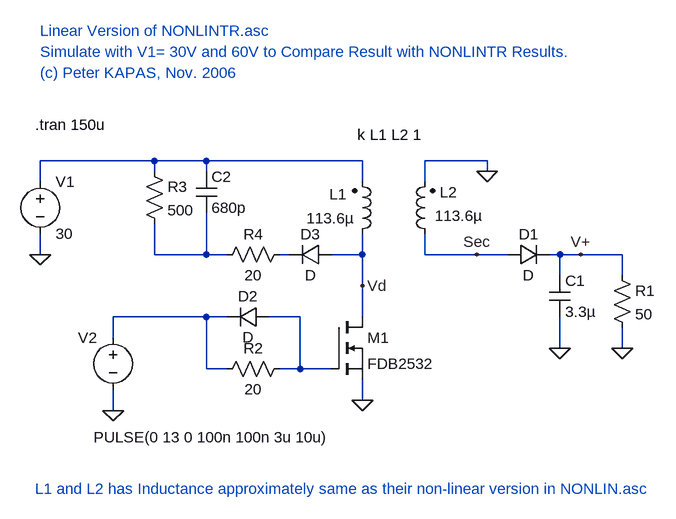
[diagram p0: schematic lineartr.asc]
lineartr.asc, the LTspice schematic file:
Version 4
SHEET 1 880 680
WIRE -256 144 -432 144
WIRE -176 144 -256 144
WIRE 64 144 -176 144
WIRE 256 144 160 144
WIRE -256 160 -256 144
WIRE -176 160 -176 144
WIRE 256 160 256 144
WIRE -432 176 -432 144
WIRE 64 176 64 144
WIRE 160 176 160 144
WIRE -432 288 -432 256
WIRE -256 288 -256 240
WIRE -176 288 -176 224
WIRE -176 288 -256 288
WIRE -144 288 -176 288
WIRE -48 288 -64 288
WIRE 64 288 64 256
WIRE 64 288 16 288
WIRE 160 288 160 256
WIRE 240 288 160 288
WIRE 288 288 240 288
WIRE 368 288 352 288
WIRE 400 288 368 288
WIRE 464 288 400 288
WIRE 368 320 368 288
WIRE 464 320 464 288
WIRE 64 336 64 288
WIRE -176 384 -320 384
WIRE -144 384 -176 384
WIRE -32 384 -80 384
WIRE 64 384 64 336
WIRE -320 416 -320 384
WIRE 368 432 368 384
WIRE 464 432 464 400
WIRE -176 464 -176 384
WIRE -144 464 -176 464
WIRE -32 464 -32 384
WIRE -32 464 -64 464
WIRE 16 464 -32 464
WIRE 64 512 64 480
WIRE -320 528 -320 496
FLAG -432 288 0
FLAG 240 288 Sec
FLAG 368 432 0
FLAG 464 432 0
FLAG 64 512 0
FLAG -320 528 0
FLAG 400 288 V+
FLAG 256 160 0
FLAG 64 336 Vd
SYMBOL voltage -432 160 R0
WINDOW 123 0 0 Left 0
WINDOW 39 0 0 Left 0
SYMATTR InstName V1
SYMATTR Value 30
SYMBOL diode 288 272 M90
WINDOW 0 0 32 VBottom 0
WINDOW 3 32 32 VTop 0
SYMATTR InstName D1
SYMBOL cap 352 320 R0
SYMATTR InstName C1
SYMATTR Value 3.3µ
SYMBOL res 448 304 R0
SYMATTR InstName R1
SYMATTR Value 50
SYMBOL voltage -320 400 M0
WINDOW 123 0 0 Left 0
WINDOW 39 0 0 Left 0
WINDOW 3 -335 169 Left 0
SYMATTR InstName V2
SYMATTR Value PULSE(0 13 0 100n 100n 3u 10u)
SYMBOL res -48 448 R90
WINDOW 0 0 56 VBottom 0
WINDOW 3 32 56 VTop 0
SYMATTR InstName R2
SYMATTR Value 20
SYMBOL diode -80 368 R90
WINDOW 0 0 32 VBottom 0
WINDOW 3 32 32 VTop 0
SYMATTR InstName D2
SYMBOL cap -192 160 R0
SYMATTR InstName C2
SYMATTR Value 680p
SYMBOL res -272 144 R0
SYMATTR InstName R3
SYMATTR Value 500
SYMBOL res -48 272 R90
WINDOW 0 0 56 VBottom 0
WINDOW 3 32 56 VTop 0
SYMATTR InstName R4
SYMATTR Value 20
SYMBOL diode 16 272 R90
WINDOW 0 0 32 VBottom 0
WINDOW 3 32 32 VTop 0
SYMATTR InstName D3
SYMBOL ind2 48 272 M180
WINDOW 0 -35 77 Left 0
WINDOW 3 -70 40 Left 0
SYMATTR InstName L1
SYMATTR Value 113.6µ
SYMATTR Type ind
SYMATTR SpiceLine Rser=0.1 Rpar=10Meg Cpar=1f
SYMBOL ind2 176 272 R180
WINDOW 0 -34 80 Left 0
WINDOW 3 -74 44 Left 0
SYMATTR InstName L2
SYMATTR Value 113.6µ
SYMATTR Type ind
SYMATTR SpiceLine Rser=0.1 Rpar=10Meg Cpar=1f
SYMBOL nmos 16 384 R0
SYMATTR InstName M1
SYMATTR Value FDB2532
TEXT -440 88 Left 0 !.tran 150u
TEXT 56 104 Left 0 !k L1 L2 1
TEXT -432 -56 Left 0 ;Linear Version of NONLINTR.asc
TEXT -432 -24 Left 0 ;Simulate with V1= 30V and 60V to Compare Result with NONLINTR Results.
TEXT -432 8 Left 0 ;(c) Peter KAPAS, Nov. 2006
TEXT -440 648 Left 0 ;L1 and L2 has Inductance approximately same as their non-linear version in NONLIN.asc

The netlist it stands for:
* lineartr.asc
V1 N001 0 30
D1 Sec V+ D
C1 V+ 0 3.3µ
R1 V+ 0 50
V2 N004 0 PULSE(0 13 0 100n 100n 3u 10u)
R2 N005 N004 20
D2 N005 N004 D
C2 N001 N002 680p
R3 N001 N002 500
R4 N003 N002 20
D3 Vd N003 D
L1 Vd N001 113.6µ Rser=0.1 Rpar=10Meg Cpar=1f
L2 Sec 0 113.6µ Rser=0.1 Rpar=10Meg Cpar=1f
M1 Vd N005 0 0 FDB2532
.model D D
.lib standard.dio
.model NMOS NMOS
.model PMOS PMOS
.lib standard.mos
.tran 150u
k L1 L2 1
* Linear Version of NONLINTR.asc
* Simulate with V1= 30V and 60V to Compare Result with NONLINTR Results.
* (c) Peter KAPAS, Nov. 2006
* L1 and L2 has Inductance approximately same as their non-linear version in NONLIN.asc
.backanno
.end